# EAGLE schematic pCog103_Wifi_Keyboard_TFT (EAGLE 6.6.0)

## Sheet 1 of 4
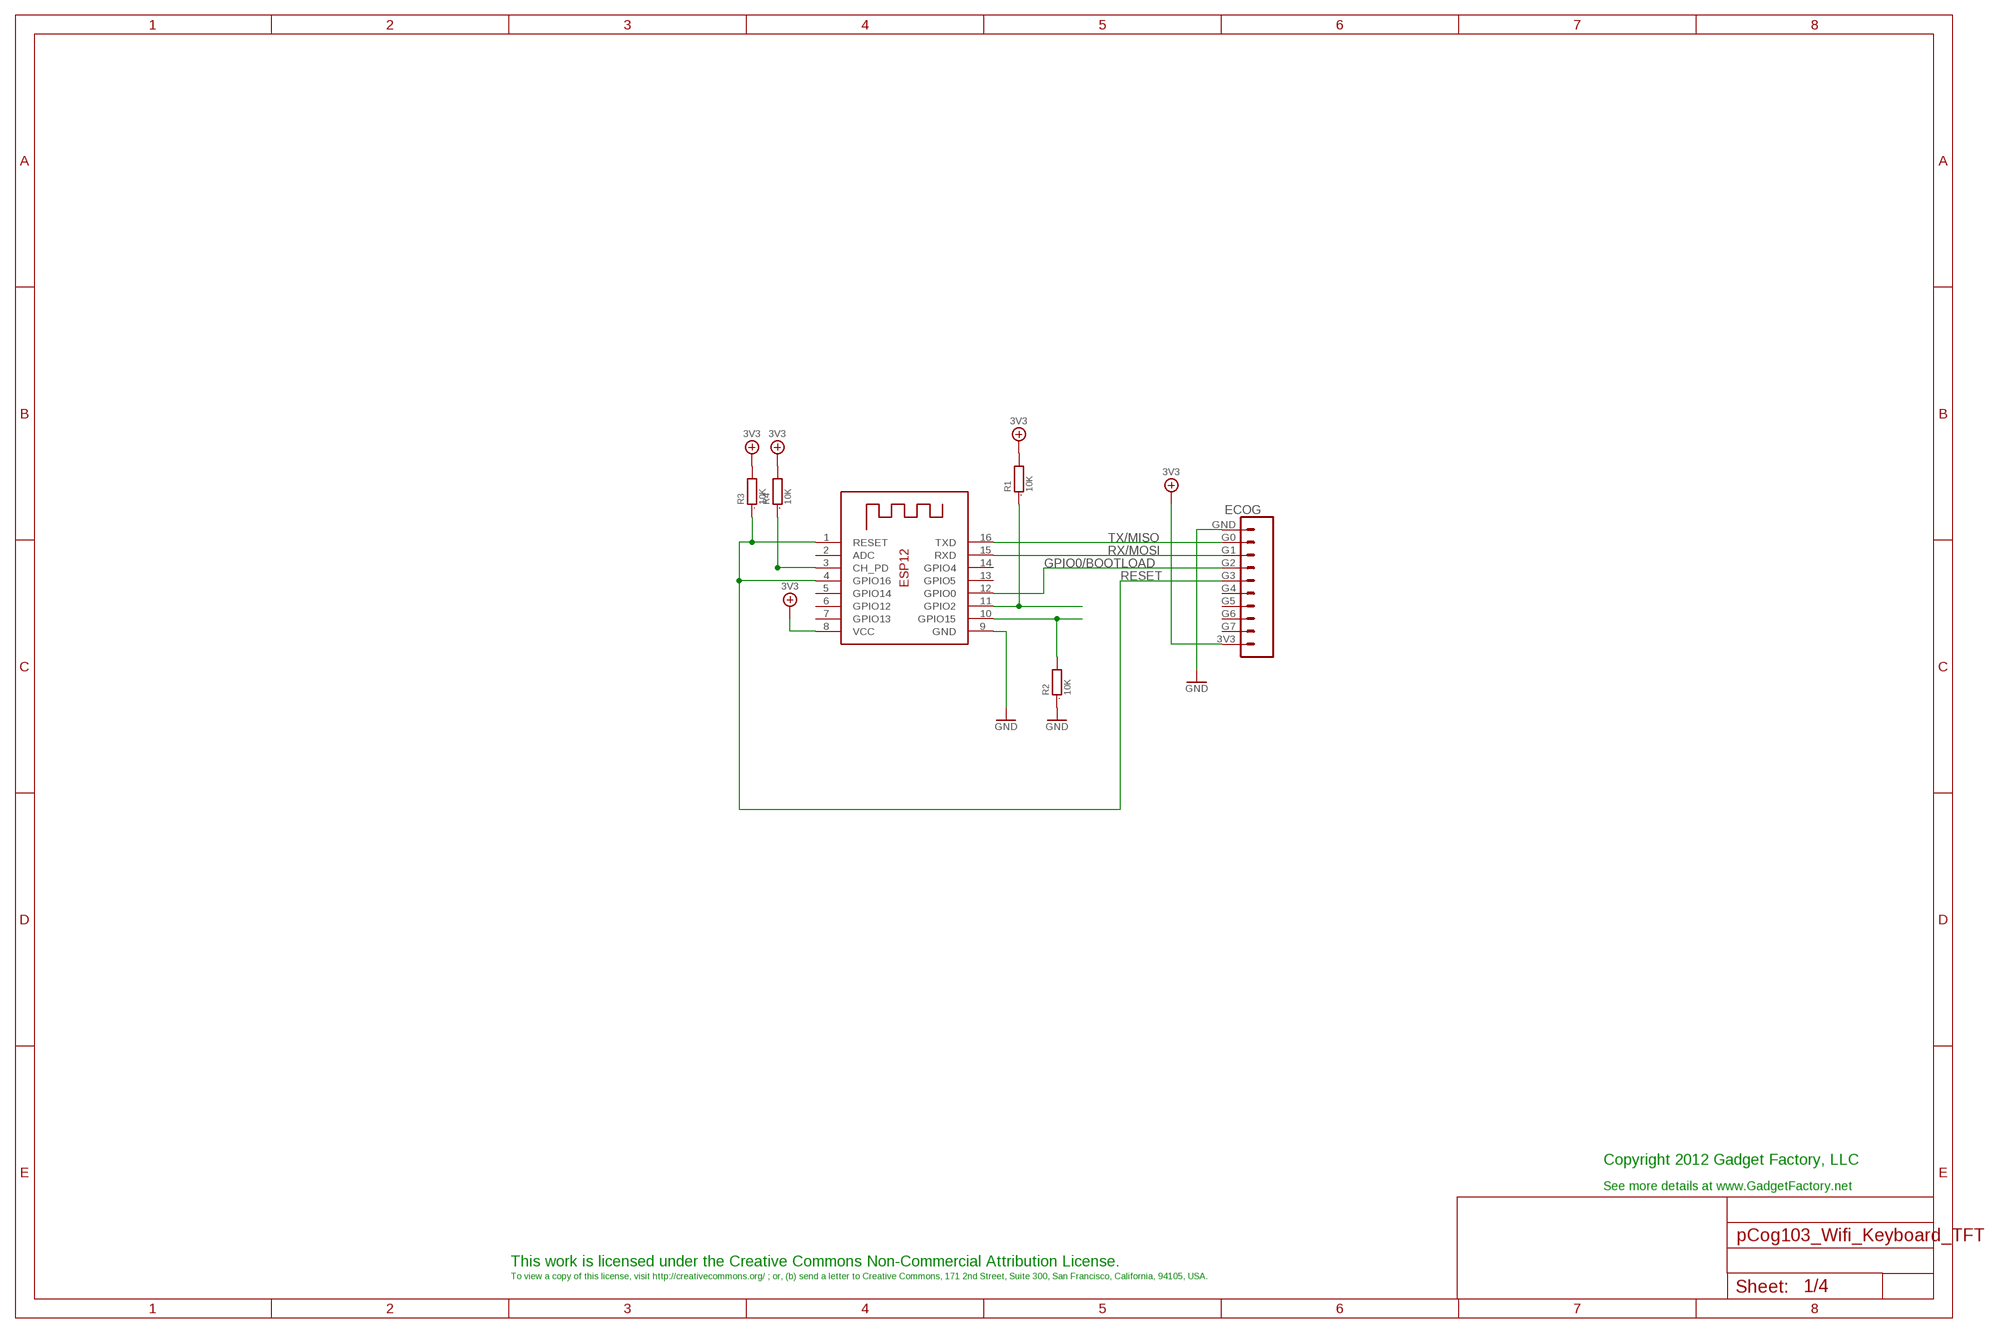
[diagram p0: schematic, sheet 1]

### Parts
ECOG  ECOG_GENERAL_ROWTHROUGHOLE  [ECOG_GENERAL_TH]
R1  10K  R0805  [0805]
R2  10K  R0805  [0805]
R3  10K  R0805  [0805]
R4  10K  R0805  [0805]
X1  ESP-12  [ESP-12]

### Nets
3V3: ECOG.3V3 R1.2 R3.2 R4.2 X1.8(VCC) ; also sheet 2,3,4
GND: ECOG.GND R2.1 X1.9(GND) ; also sheet 2,3,4
GPIO0/BOOTLOAD: ECOG.G2 X1.12(GPIO0)
N$3: R1.1 X1.11(GPIO2)
N$4: R2.2 X1.10(GPIO15)
N$5: R4.1 X1.3(CH_PD)
RESET: ECOG.G3 R3.1 X1.1(RESET) X1.4(GPIO16)
RX/MOSI: ECOG.G1 X1.15(RXD)
TX/MISO: ECOG.G0 X1.16(TXD)
Unconnected: ECOG.G4 ECOG.G5 ECOG.G6 ECOG.G7 X1.2(ADC) X1.5(GPIO14) X1.6(GPIO12) X1.7(GPIO13) X1.13(GPIO5) X1.14(GPIO4)

### Notes on the sheet
- Copyright 2012 Gadget Factory, LLC
- See more details at www.GadgetFactory.net
- This work is licensed under the Creative Commons Non-Commercial Attribution License.
- To view a copy of this license, visit http://creativecommons.org/ ; or, (b) send a letter to Creative Commons, 171 2nd Street, Suite 300, San Francisco, California, 94105, USA.

## Sheet 2 of 4
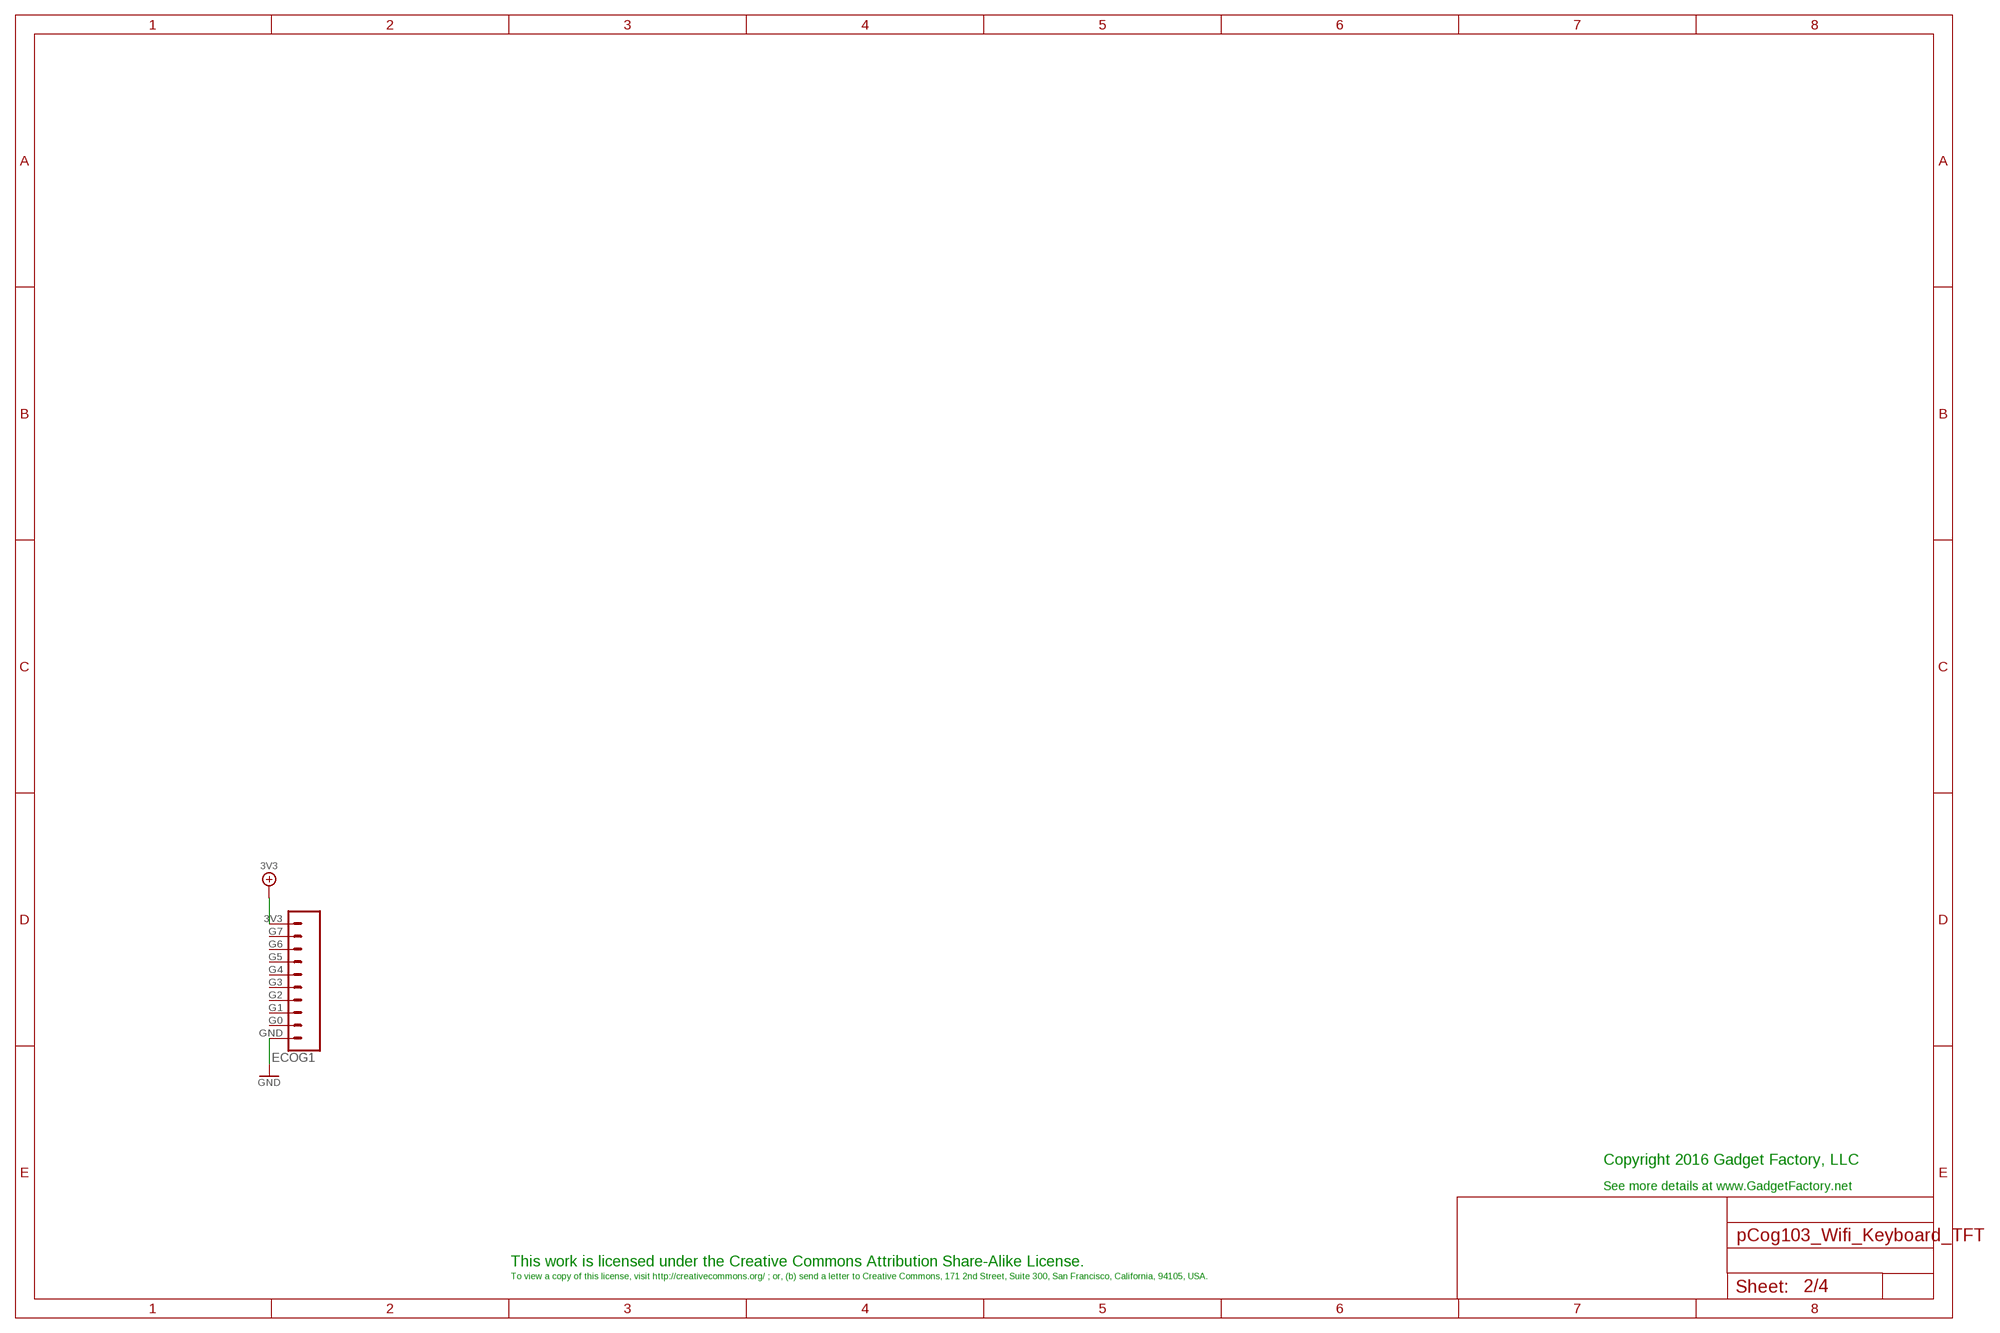
[diagram p1: schematic, sheet 2]

### Parts
ECOG1  ECOG_GENERAL_ROWSURFACEMOUNT  [ECOG_GENERAL_SMD]

### Nets
3V3: ECOG1.3V3 ; also sheet 1,3,4
GND: ECOG1.GND ; also sheet 1,3,4
Unconnected: ECOG1.G0 ECOG1.G1 ECOG1.G2 ECOG1.G3 ECOG1.G4 ECOG1.G5 ECOG1.G6 ECOG1.G7

### Notes on the sheet
- Copyright 2016 Gadget Factory, LLC
- See more details at www.GadgetFactory.net
- This work is licensed under the Creative Commons Attribution Share-Alike License.
- To view a copy of this license, visit http://creativecommons.org/ ; or, (b) send a letter to Creative Commons, 171 2nd Street, Suite 300, San Francisco, California, 94105, USA.

## Sheet 3 of 4
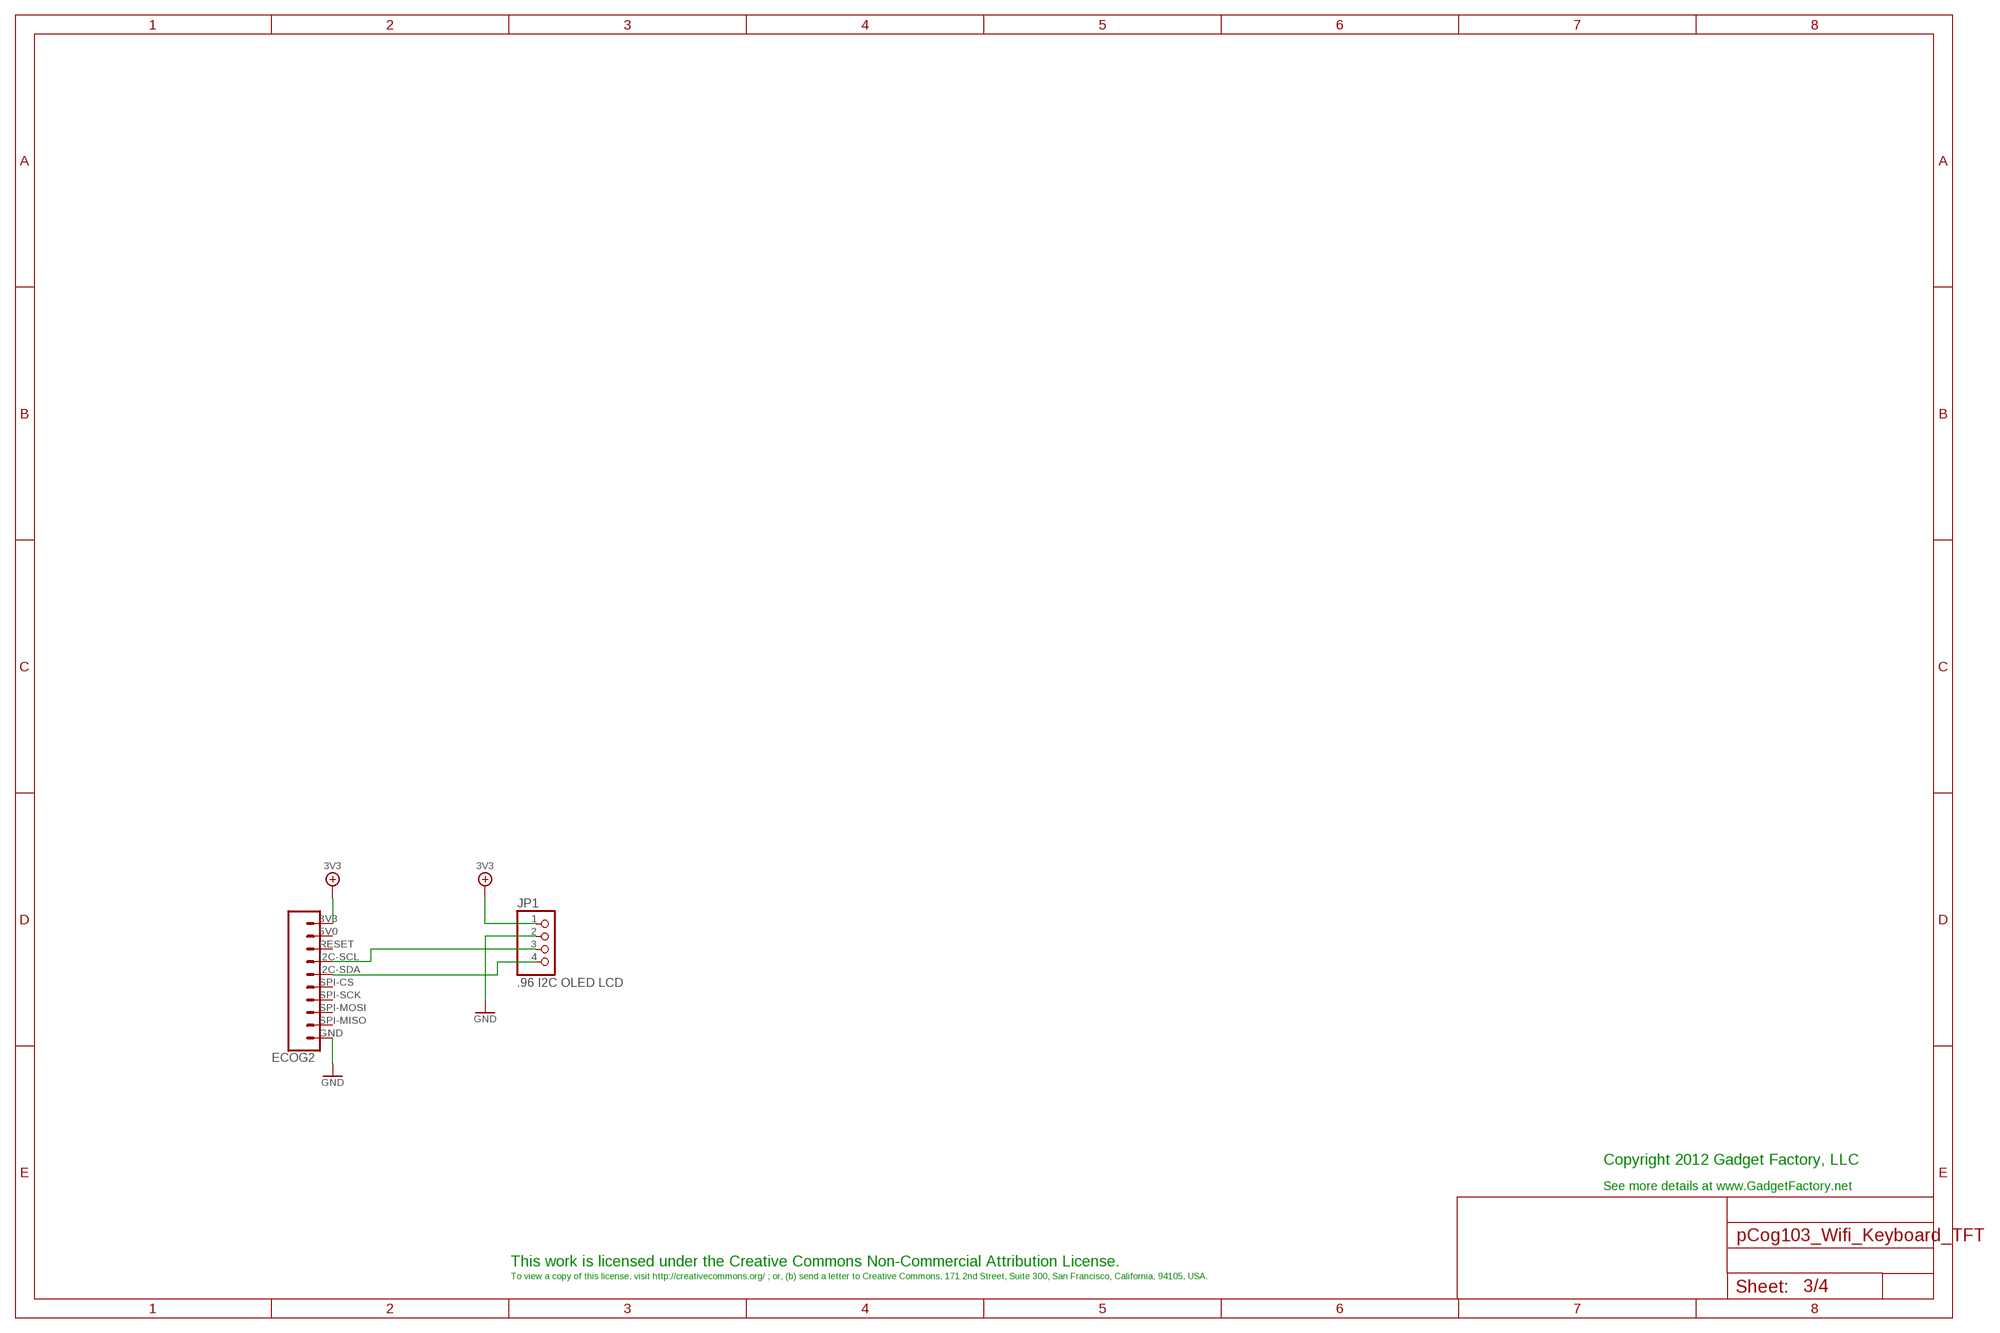
[diagram p2: schematic, sheet 3]

### Parts
ECOG2  ECOG_BUSES_ROWTHROUGHHOLE  [ECOG_BUSES_TH]
JP1  .96 I2C OLED LCD  PINHD-1X4  [1X04]

### Nets
3V3: ECOG2.3V3 JP1.1 ; also sheet 1,2,4
GND: ECOG2.GND JP1.2 ; also sheet 1,2,4
N$1: ECOG2.I2C-SCL JP1.3
N$2: ECOG2.I2C-SDA JP1.4
Unconnected: ECOG2.5V0(RSV) ECOG2.RESET(RSV) ECOG2.SPI-CS ECOG2.SPI-MISO ECOG2.SPI-MOSI ECOG2.SPI-SCK

### Notes on the sheet
- Copyright 2012 Gadget Factory, LLC
- See more details at www.GadgetFactory.net
- This work is licensed under the Creative Commons Non-Commercial Attribution License.
- To view a copy of this license, visit http://creativecommons.org/ ; or, (b) send a letter to Creative Commons, 171 2nd Street, Suite 300, San Francisco, California, 94105, USA.

## Sheet 4 of 4
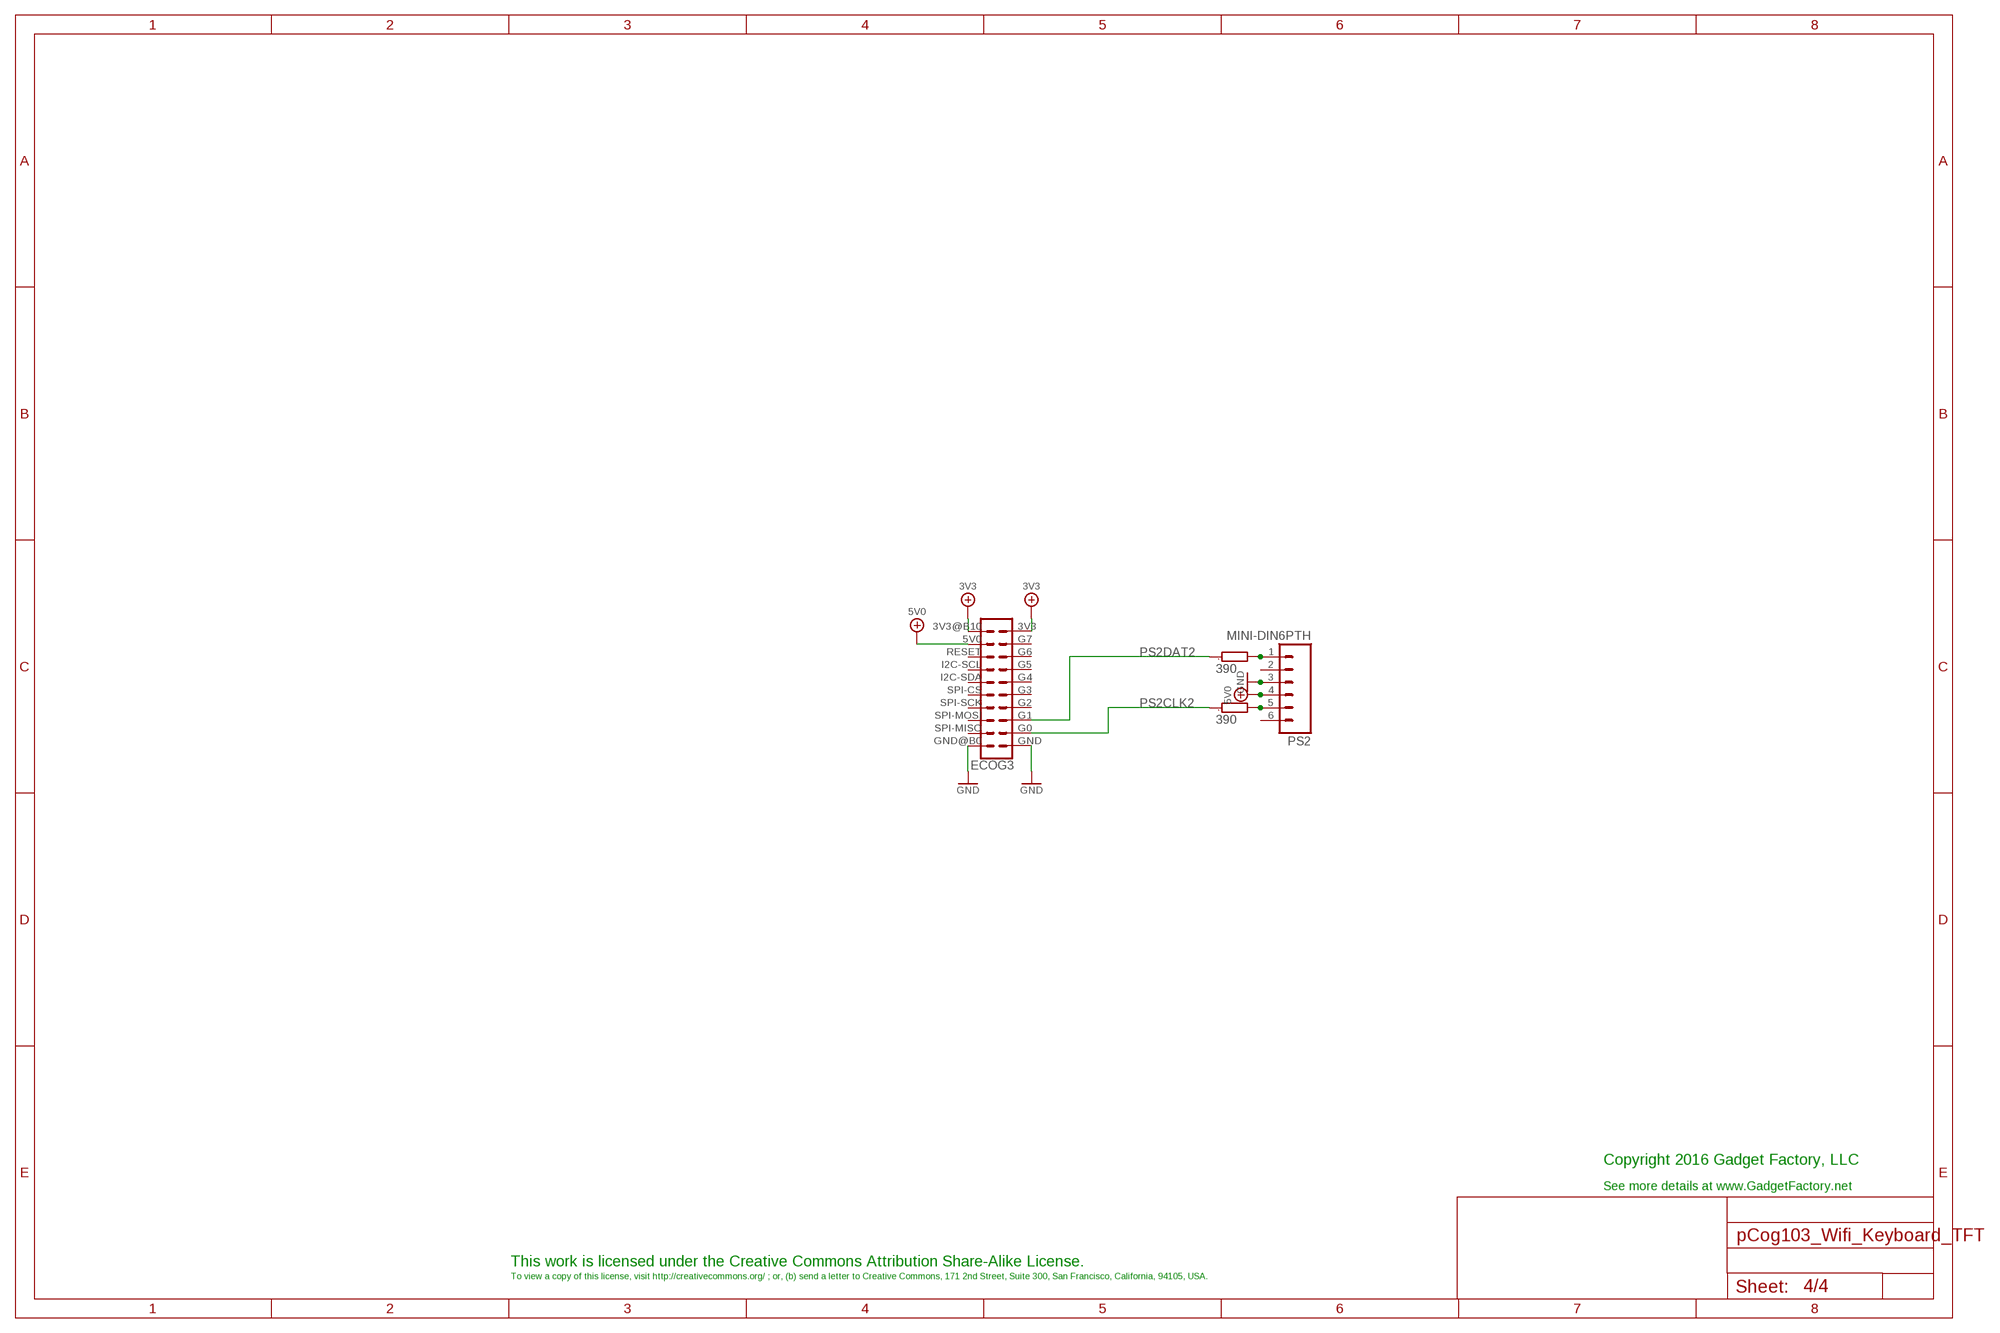
[diagram p3: schematic, sheet 4]

### Parts
ECOG3  ECOG_DUALTHROUGHHOLE  [ECOG_DUAL_TH]
PS2  MINI-DIN6PTH  [MINI-DIN6]
R5  390  R0603  [0603]
R6  390  R0603  [0603]

### Nets
3V3: ECOG3.3V3 ECOG3.3V3@B10(3V3) ; also sheet 1,2,3
5V0: ECOG3.5V0(5V) PS2.4
GND: ECOG3.GND ECOG3.GND@B0(GND) PS2.3 ; also sheet 1,2,3
N$14: PS2.1 R5.2
N$15: PS2.5 R6.2
PS2CLK2: ECOG3.G0 R6.1
PS2DAT2: ECOG3.G1 R5.1
Unconnected: ECOG3.G2 ECOG3.G3 ECOG3.G4 ECOG3.G5 ECOG3.G6 ECOG3.G7 ECOG3.I2C-SCL ECOG3.I2C-SDA ECOG3.RESET ECOG3.SPI-CS ECOG3.SPI-MISO ECOG3.SPI-MOSI ECOG3.SPI-SCK PS2.2 PS2.6

### Notes on the sheet
- Copyright 2016 Gadget Factory, LLC
- See more details at www.GadgetFactory.net
- This work is licensed under the Creative Commons Attribution Share-Alike License.
- To view a copy of this license, visit http://creativecommons.org/ ; or, (b) send a letter to Creative Commons, 171 2nd Street, Suite 300, San Francisco, California, 94105, USA.

## Library data of the parts
ECOG = eCogs:ECOG_GENERAL_ROW
ECOG1 = eCogs:ECOG_GENERAL_ROW; DIGIKEY: S1013EC-10-ND
ECOG2 = eCogs:ECOG_BUSES_ROW
ECOG3 = eCogs:ECOG_DUAL
JP1 = pinhead:PINHD-1X4: PIN HEADER; DEALEXTREME: 419232
PS2 = SparkFun-Connectors:MINI-DIN6: mini DIN 6 Connector Commonly found on the back of a computer for PS2 keyboard and mice. Schematic and footprint are proven. Spark Fun Electronics SKU : PRT-08509
R1-R4 = GadgetFactory:R: RESISTOR, European symbol; DIGIKEY: RMCF0805JT10K0CT-ND
R5 R6 = GadgetFactory:R: RESISTOR, European symbol
X1 = adafruit:ESP-12; ADAFRUIT: 2491